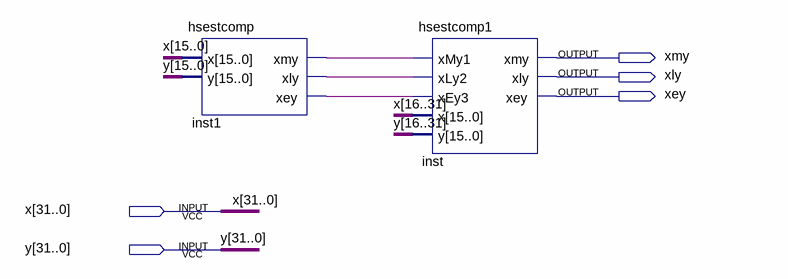
[diagram p0: schematic sheet]
// Quartus schematic tronecomp.bdf as structural Verilog: 2 symbols, 5 pins
module tronecomp (
  input  [31:0] x,
  input  [31:0] y,
  output xmy,
  output xly,
  output xey
);

  wire inst1_xey, inst1_xly, inst1_xmy;

  hsestcomp inst1 (.x(x[15:0]), .y(y[15:0]), .xmy(inst1_xmy), .xly(inst1_xly), .xey(inst1_xey));
  hsestcomp1 inst (
    .xMy1(inst1_xmy), .xLy2(inst1_xly), .xEy3(inst1_xey),
    .x({x[16], x[17], x[18], x[19], x[20], x[21], x[22], x[23], x[24], x[25], x[26], x[27], x[28], x[29], x[30], x[31]}),
    .y({y[16], y[17], y[18], y[19], y[20], y[21], y[22], y[23], y[24], y[25], y[26], y[27], y[28], y[29], y[30], y[31]}),
    .xmy(xmy), .xly(xly), .xey(xey));
endmodule
